# Altium schematic sheet Open_Rally_Computer.SchDoc
size 594 x 420 mm
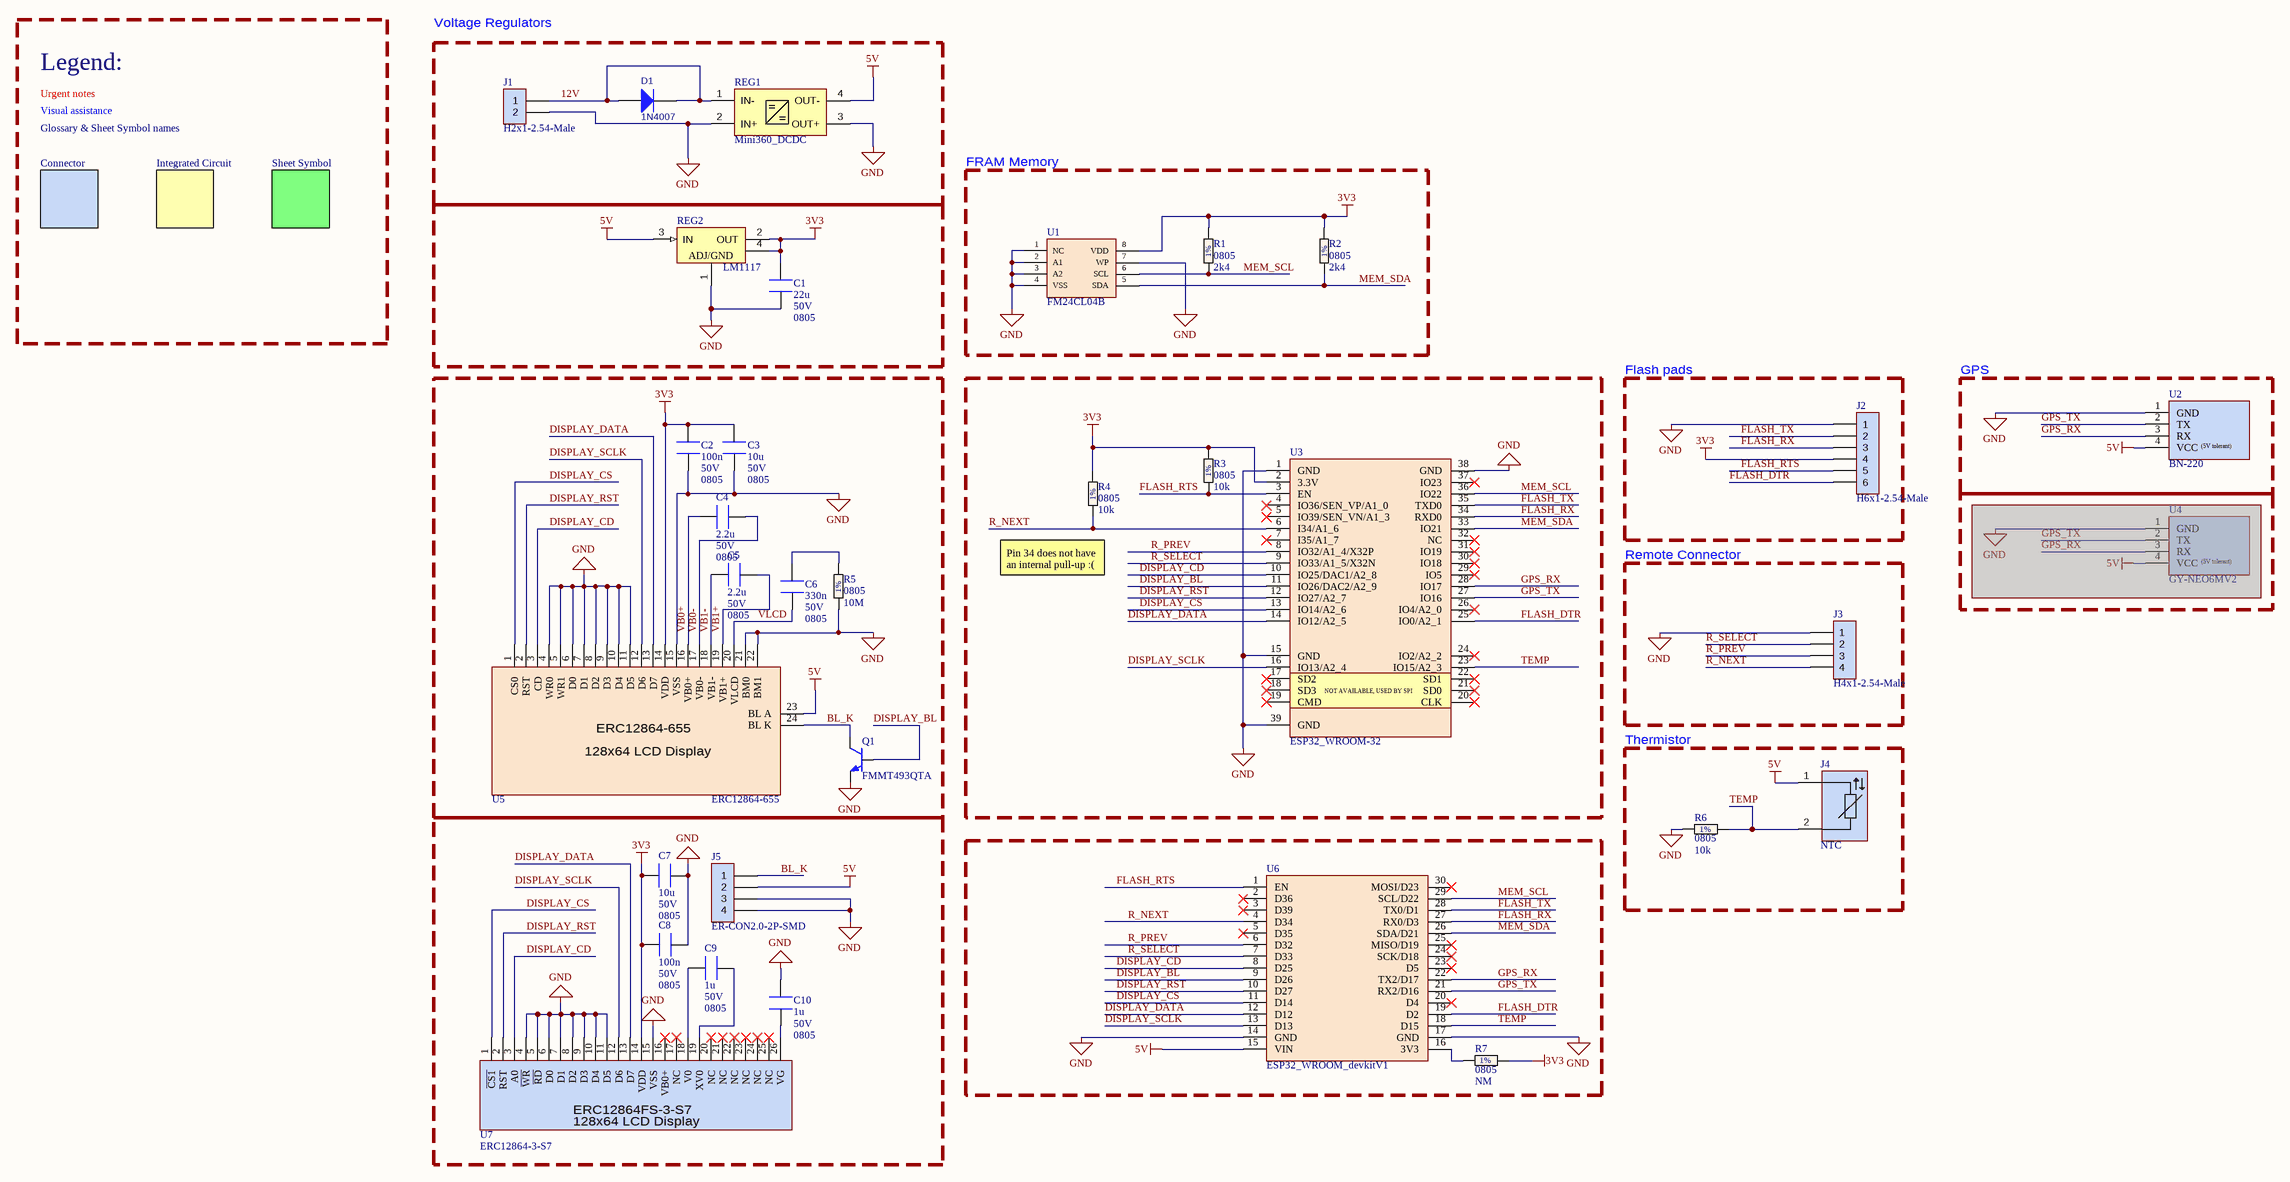
[diagram p0: Open_Rally_Computer.SchDoc]

## Parts
C1  value 22u  Voltage: 50V  Case: 0805  [C0805]  (hidden comment: CAP_CERAMIC_0805)
C2  value 100n  Voltage: 50V  Case: 0805  [C0805]  (hidden comment: CAP_CERAMIC_0805)
C3  value 10u  Voltage: 50V  Case: 0805  [C0805]  (hidden comment: CAP_CERAMIC_0805)
C4  value 2.2u  Voltage: 50V  Case: 0805  [C0805]  (hidden comment: CAP_CERAMIC_0805)
C5  value 2.2u  Voltage: 50V  Case: 0805  [C0805]  (hidden comment: CAP_CERAMIC_0805)
C6  value 330n  Voltage: 50V  Case: 0805  [C0805]  (hidden comment: CAP_CERAMIC_0805)
C7  value 10u  Voltage: 50V  Case: 0805  [C0805]  (hidden comment: CAP_CERAMIC_0805)
C8  value 100n  Voltage: 50V  Case: 0805  [C0805]  (hidden comment: CAP_CERAMIC_0805)
C9  value 1u  Voltage: 50V  Case: 0805  [C0805]  (hidden comment: CAP_CERAMIC_0805)
C10  value 1u  Voltage: 50V  Case: 0805  [C0805]  (hidden comment: CAP_CERAMIC_0805)
D1  1N4007  [SOD-123F]
J1  H2x1-2.54-Male  [HDR_P254_2x1]
J2  H6x1-2.54-Male  [HDR_P254_6x1]
J3  H4x1-2.54-Male  [HDR_P254_4x1]
J4  NTC  [HDR_P254_2x1]
J5  ER-CON2.0-2P-SMD  [ER-CON2.0-2P-SMD]
Q1  FMMT493QTA  [SOT-23]
R1  value 2k4  Case: 0805  Tolerance: 1%  [R0805]  (hidden comment: RES_0805)
R2  value 2k4  Case: 0805  Tolerance: 1%  [R0805]  (hidden comment: RES_0805)
R3  value 10k  Case: 0805  Tolerance: 1%  [R0805]  (hidden comment: RES_0805)
R4  value 10k  Case: 0805  Tolerance: 1%  [R0805]  (hidden comment: RES_0805)
R5  value 10M  Case: 0805  Tolerance: 1%  [R0805]  (hidden comment: RES_0805)
R6  value 10k  Case: 0805  Tolerance: 1%  [R0805]  (hidden comment: RES_0805)
R7  value NM  Case: 0805  Tolerance: 1%  [R0805]  (hidden comment: RES_0805)
REG1  Mini360_DCDC  [Mini360-DCDC]
REG2  LM1117  [SOT-223-4]
U1  FM24CL04B  [SOIC-8N]
U2  BN-220  [BN-220]
U3  ESP32_WROOM-32  [ESP32_WROOM_32S]
U4  GY-NEO6MV2  [GY-NEO6MV2]  (masked out: inside a compile mask, not in the netlist)
U5  ERC12864-655  [ERC12864-655]
U6  ESP32_WROOM_devkitV1  [ESP32_WROOM_32S_devkitV1]
U7  ERC12864-3-S7  [ER-CON26HB-1]

## Blocks framed on the sheet
Voltage Regulators: D1 J1 REG1
FRAM Memory: R1 R2 U1
Flash pads: J2
GPS: U2
Remote Connector: J3
Thermistor: J4 R6

## Nets
3V3: C1.2 C2.2 C3.2 C7.2 C8.1 J2.4 R1.2 R2.2 R3.1 R4.1 R7.2 REG2.2(OUT) REG2.4(OUT) U1.8(VDD) U3.2(3.3V) U5.14(VDD) U7.14(VDD)
5V: J4.1 J5.2 REG1.4(OUT-) REG2.3(IN) U2.4(VCC) U5.23(BL_A) U6.15(VIN)
GND: C1.1 C2.1 C3.1 C7.1 C8.2 C10.2 J1.2 J2.1 J3.1 J5.3 J5.4 Q1.2(E) R5.1 R6.1 REG1.2(IN+) REG1.3(OUT+) REG2.1(ADJ) U1.1(NC) U1.2(A1) U1.3(A2) U1.4(VSS) U1.7(WP) U2.1(GND) U3.1(GND) U3.15(GND) U3.38(GND) U3.39(GND) U5.4(WR0) U5.5(WR1) U5.6(D0) U5.7(D1) U5.8(D2) U5.9(D3) U5.10(D4) U5.11(D5) U5.15(VSS) U5.21(BM0) U5.22(BM1) U6.14(GND) U6.17(GND) U7.4(~{WR}) U7.5(~{RD}) U7.6(D0) U7.7(D1) U7.8(D2) U7.9(D3) U7.10(D4) U7.11(D5) U7.15(VSS)
12V: D1.A D1.k(K) J1.1 REG1.1(IN-)
BL_K: J5.1 Q1.3(C) U5.24(BL_K)
DISPLAY_BL: Q1.1(B) U3.11(IO26/DAC2/A2_9) U6.9(D26)
DISPLAY_CD: U3.10(IO25/DAC1/A2_8) U5.3(CD) U6.8(D25) U7.3(A0)
DISPLAY_CS: U3.13(IO14/A2_6) U5.1(CS0) U6.11(D14) U7.1(~{CS1})
DISPLAY_DATA: U3.14(IO12/A2_5) U5.13(D7) U6.12(D12) U7.13(D7)
DISPLAY_RST: U3.12(IO27/A2_7) U5.2(RST) U6.10(D27) U7.2(RST)
DISPLAY_SCLK: U3.16(IO13/A2_4) U5.12(D6) U6.13(D13) U7.12(D6)
FLASH_DTR: J2.6 U3.25(IO0/A2_1) U6.19(D2)
FLASH_RTS: J2.5 R3.2 U3.3(EN) U6.1(EN)
FLASH_RX: J2.3 U3.34(RXD0) U6.27(RX0/D3)
FLASH_TX: J2.2 U3.35(TXD0) U6.28(TX0/D1)
GPS_RX: U2.3(RX) U3.28(IO17) U6.22(TX2/D17)
GPS_TX: U2.2(TX) U3.27(IO16) U6.21(RX2/D16)
MEM_SCL: R1.1 U1.6(SCL) U3.36(IO22) U6.29(SCL/D22)
MEM_SDA: R2.1 U1.5(SDA) U3.33(IO21) U6.26(SDA/D21)
R_NEXT: J3.4 R4.2 U3.6(I34/A1_6) U6.4(D34)
R_PREV: J3.3 U3.8(IO32/A1_4/X32P) U6.6(D32)
R_SELECT: J3.2 U3.9(IO33/A1_5/X32N) U6.7(D33)
TEMP: J4.2 R6.2 U3.23(IO15/A2_3) U6.18(D15)
VB0+: C4.2 U5.16(VB0+)
VB0-: C4.1 U5.17(VB0-)
VB1+: C5.1 U5.19(VB1+)
VB1-: C5.2 U5.18(VB1-)
VLCD: C6.1 U5.20(VLCD)
NetC6_2: C6.2 R5.2
NetC9_1: C9.1 U7.19(XV0)
NetC9_2: C9.2 U7.18(V0)
NetC10_1: C10.1 U7.26(VG)
NetR7_1: R7.1 U6.16(3V3)

Not connected (* = marked no-connect by the designer): U3 4(IO36/SEN_VP/A1_0)* 5(IO39/SEN_VN/A1_3)* 7(I35/A1_7)* 17(SD2)* 18(SD3)* 19(CMD)* 20(CLK)* 21(SD0)* 22(SD1)* 24(IO2/A2_2)* 26(IO4/A2_0)* 29(IO5)* 30(IO18)* 31(IO19)* 32(NC)* 37(IO23)*; U6 2(D36)* 3(D39)* 5(D35)* 20(D4)* 23(D5)* 24(SCK/D18)* 25(MISO/D19)* 30(MOSI/D23)*; U7 16(VB0+)* 17(NC)* 20(NC)* 21(NC)* 22(NC)* 23(NC)* 24(NC)* 25(NC)*

## Notes on the sheet
- Legend:
- Visual assistance
- Urgent notes
- Connector
- Glossary & Sheet Symbol names
- Integrated Circuit
- Sheet Symbol
- (near R4) Pin 34 does not have
  an internal pull-up :(
- DWG NO:
- REV:
- THIS DOCUMENT AND THE DATA DISCLOSED HEREIN OR
- HEREWITH IS THE PROPERTY OF ALTIUM LIMITED AND MAY
- BE FREELY DISTRIBUTED IN WHOLE. NO RIGHTS ARE
- RESERVED OR EXPRESS OR IMPLIED WARANTEE GIVEN.
- REVISION
- DESCRIPTION
- DATE
- APPROVED
- ENG:
- APPROVALS
- PROJECT
- DSN:
- CHK:
- REFERENCE DOCUMENTS
- PROJECT REVISION:
- TITLE
- DOCUMENT REVISION:
- DESIGN ITEM:
- BOM:
- FAB DWG:
- PCB DWG:
- ASSY DWG:
- SCALE:
- A2
- SIZE
- CAGE CODE
- FILE NAME
- DWG NO.
- SHEET
- OF
- REV
- (in symbol BN-220) (5V tolerant)
- (in symbol ERC12864-3-S7) ERC12864FS-3-S7; 128x64 LCD Display
- (in symbol ERC12864-655) 128x64 LCD Display
- (in symbol ESP32_WROOM-32) NOT AVAILABLE, USED BY SPI
- (in symbol GY-NEO6MV2) (5V tolerant)
- (in symbol LM1117) ADJ/GND

## Library data of the parts
C1-C10 = CAP_CERAMIC_0805: Capacitor Ceramic 0805 No Polarized; 01_Type: CAPACITOR; 02_Generic Part Number: *; 03_Part Number: *; 04_Manufacturer: *; 05_RS Part Number: *; 06_Farnell Part Number: *; 07_Mouser Part Number: *; 08_Digi-Key Part Number: *; 09_helpURL: *; Check Footprint: NO; Check Symbol: NO
D1 = 1N4007: BOM_Manufacturer: Hottech; Contributor: LCSC; BOM_Supplier Part: C181127; BOM_Supplier: LCSC; BOM_Manufacturer Part: 1N4007; spicePre: D
J1 = H2x1-2.54-Male: Header male 2x1 2.54mm; 01_Type: Connectors
J2 = H6x1-2.54-Male: Header female 6x1 2.54mm; 01_Type: Connectors
J3 = H4x1-2.54-Male: Header male 4x1 2.54mm; 01_Type: Connectors
J4 = NTC: NTC thermistor; 01_Type: Connector
J5 = ER-CON2.0-2P-SMD: 2pin 2mm pitch smd connector; 01_Type: Connectors
Q1 = FMMT493QTA: Transistores bipolares - BJT 100V NPN Med PWR 1A Ic 2A Icm 500mW; 04_Manufacturer: Diodes Incorporated; 01_Type: BJT-P; Check Footprint: NO; 03_Part Number: FMMT493QTA; 07_Mouser Part Number: 621-FMMT493QTA; Value: FMMT493QTA; Check Symbol: NO
R1-R7 = RES_0805: Resistor 0805; Check Footprint: NO; 01_Type: RESISTOR; 02_Generic Part Number: *; 03_Part Number: *; 04_Manufacturer: *; 05_RS Part Number: *; 06_Farnell Part Number: *; 07_Mouser Part Number: *; 08_Digi-Key Part Number: *; 09_helpURL: *; Power: *; Check Symbol: NO
REG1 = Mini360_DCDC: Mini360 DC-DC Buck Converter Step Down Power Supply Module 4.75V-23V to 1V-17V 340KHz; 01_Type: Regulators; 02_Generic Part Number: Mini360_DCDC
REG2 = LM1117: Reguladores de voltaje LDO 800MA LDO LINEAR REG; 03_Part Number: LM1117MPX-3.3/NOPB; 04_Manufacturer: TEXAS INSTRUMENTS; 01_Type: Regulators; 02_Generic Part Number: LM1117; 07_Mouser Part Number: 926-LM1117MPX3.3NOPB; Value: LM1117; Component Kind: Standard
U1 = FM24CL04B: F-RAM 4Kb Serial I2C 3V FRAM; 03_Part Number: FM24CL04B-GTR; 04_Manufacturer: Infineon Technologies; 01_Type: IC; 02_Generic Part Number: FM24CL04B; 07_Mouser Part Number: 877-FM24CL04B-GTR
U2 = BN-220: Beitian UBX G7020 M8030 G-MOUSE supports GPS QZSS and SBAS; 01_Type: IC; 02_Generic Part Number: BN-220; 03_Part Number: BN-220; 04_Manufacturer: Beitian
U3 = ESP32_WROOM-32: Módulos multiprotocolo SMD Module ESP32-WROOM-32E, ESP32-D0WD-V3, 16 MB SPI flash, PCB antenna; 03_Part Number: ESP32-WROOM-32E-N16; 04_Manufacturer: Espressif Systems; 01_Type: IC; 02_Generic Part Number: ESP32-WROOM-32; 07_Mouser Part Number: 356-ESP32WRM32E128PH; 09_helpURL: https://docs.espressif.com/projects/esp-idf/en/latest/esp32/hw-reference/esp32/get-started-devkitc.html
U4 = GY-NEO6MV2: uBlox Neo 6M breakout board; 04_Manufacturer: Beitian; 01_Type: IC; 02_Generic Part Number: GY-NEO6MV2; 03_Part Number: GY-NEO6MV2
U5 = ERC12864-655: 2.8"128x64 Graphic Module Serial Display SPI LCD w/OPTL Touch Screen; 04_Manufacturer: EastRising; 01_Type: IC; 02_Generic Part Number: ERC12864-655; 03_Part Number: ERC12864-655; 09_helpURL: https://www.buydisplay.com/2-8-inch-128x64-graphic-module-serial-display-spi-lcd-w-optl-touch-screen
U6 = ESP32_WROOM_devkitV1: Módulos multiprotocolo SMD Module ESP32-WROOM-32E, ESP32-D0WD-V3, 16 MB SPI flash, PCB antenna; 03_Part Number: ESP32-WROOM-32E-N16; 04_Manufacturer: Espressif Systems; 01_Type: IC; 02_Generic Part Number: ESP32-WROOM; 07_Mouser Part Number: 356-ESP32WRM32E128PH; 09_helpURL: https://docs.espressif.com/projects/esp-idf/en/latest/esp32/hw-reference/esp32/get-started-devkitc.html
U7 = ERC12864-3-S7: 2.9"COG LCD Module 128x64 Display Arduino,ST7567S,Black on White; 02_Generic Part Number: ERC12864-655; 04_Manufacturer: EastRising; 01_Type: IC; 03_Part Number: ERC12864-655; 09_helpURL: https://www.buydisplay.com/2-8-inch-128x64-graphic-module-serial-display-spi-lcd-w-optl-touch-screen